# Altium schematic sheet NIR-Spec-Motherboard-SCH_SH1_(02).SchDoc: SCHEMATIC, CCA,
size 863 x 558 mm; DocumentNumber: NIR-Spec-1; SheetNumber: 1; SheetTotal: 3
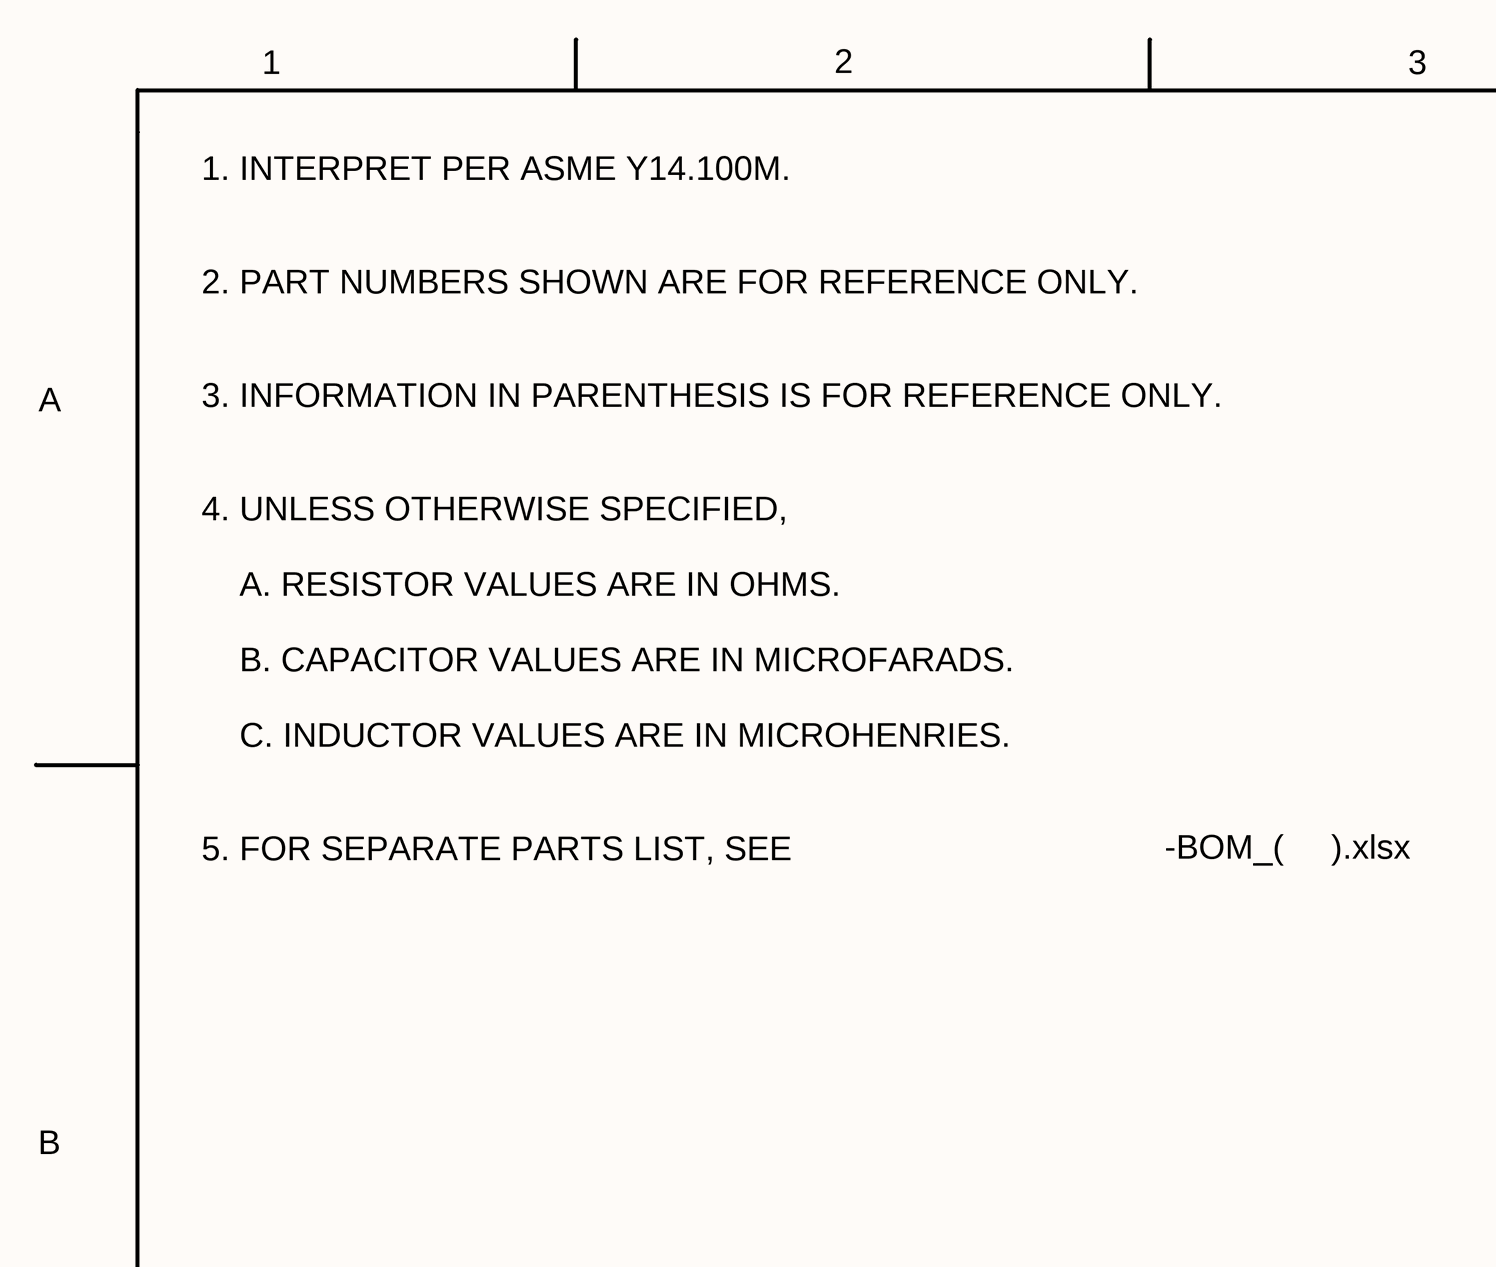
[diagram p0: NIR-Spec-Motherboard-SCH_SH1_(02).SchDoc, top left]
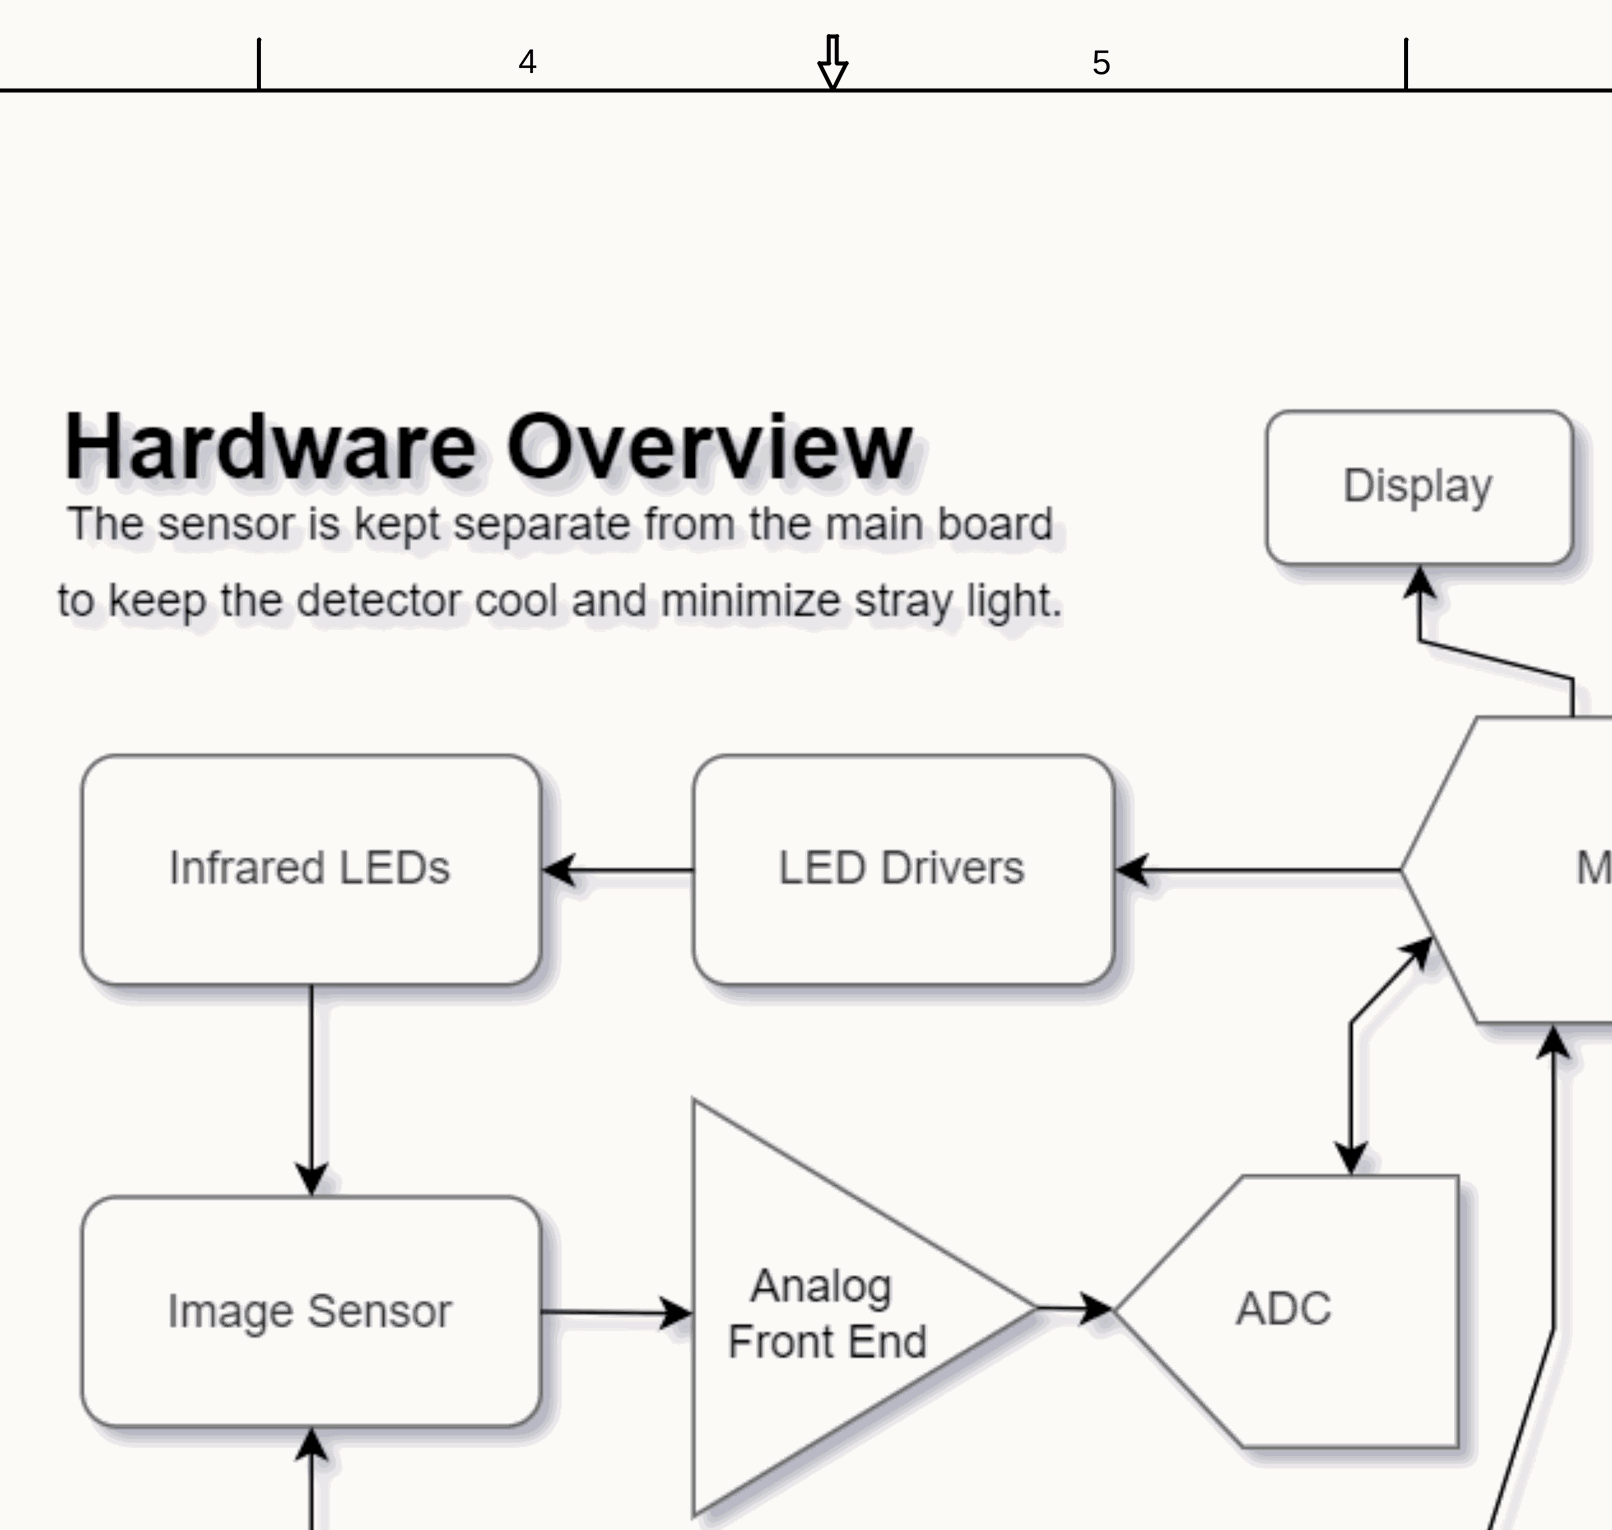
[diagram p1: NIR-Spec-Motherboard-SCH_SH1_(02).SchDoc, top middle]
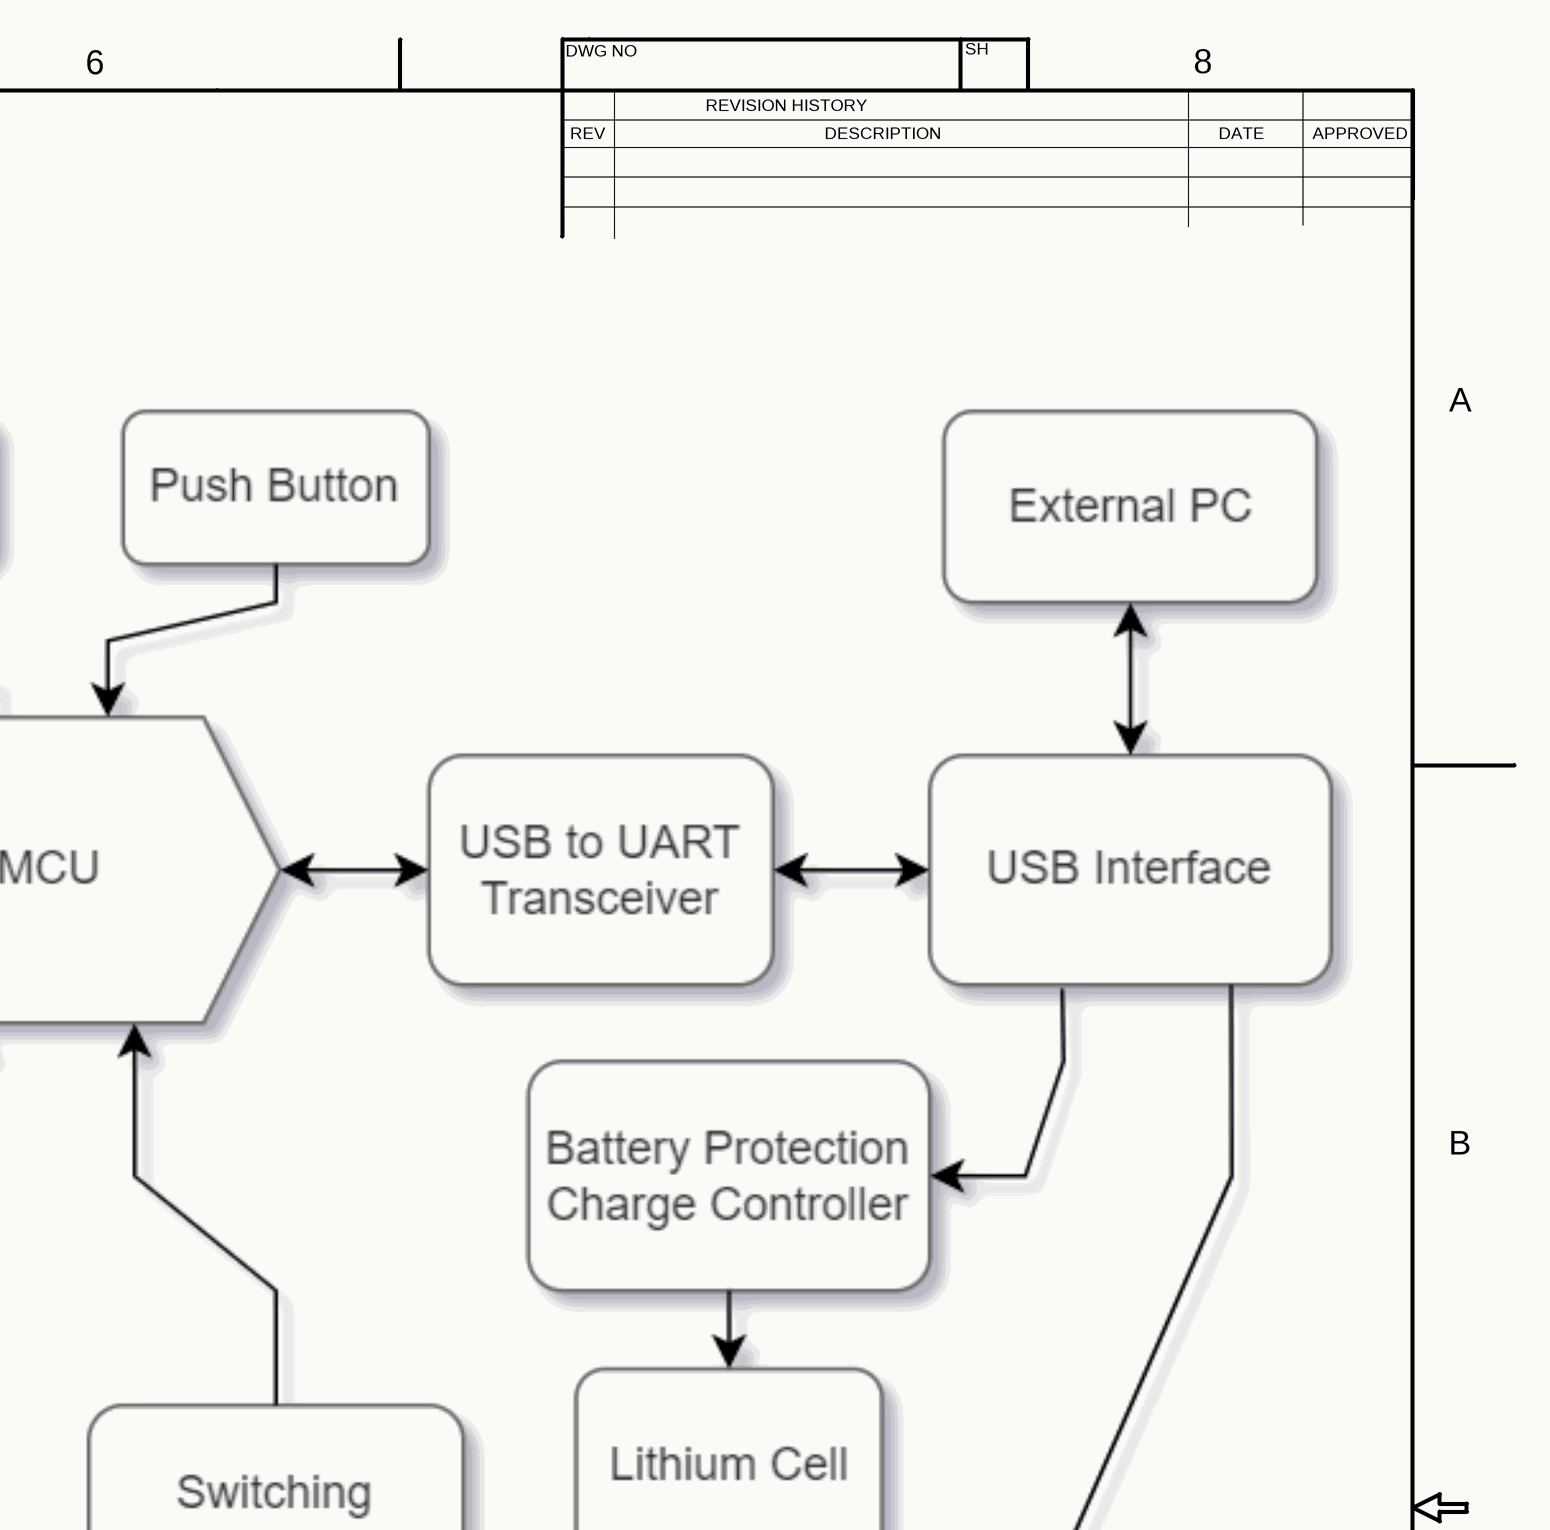
[diagram p2: NIR-Spec-Motherboard-SCH_SH1_(02).SchDoc, top right]
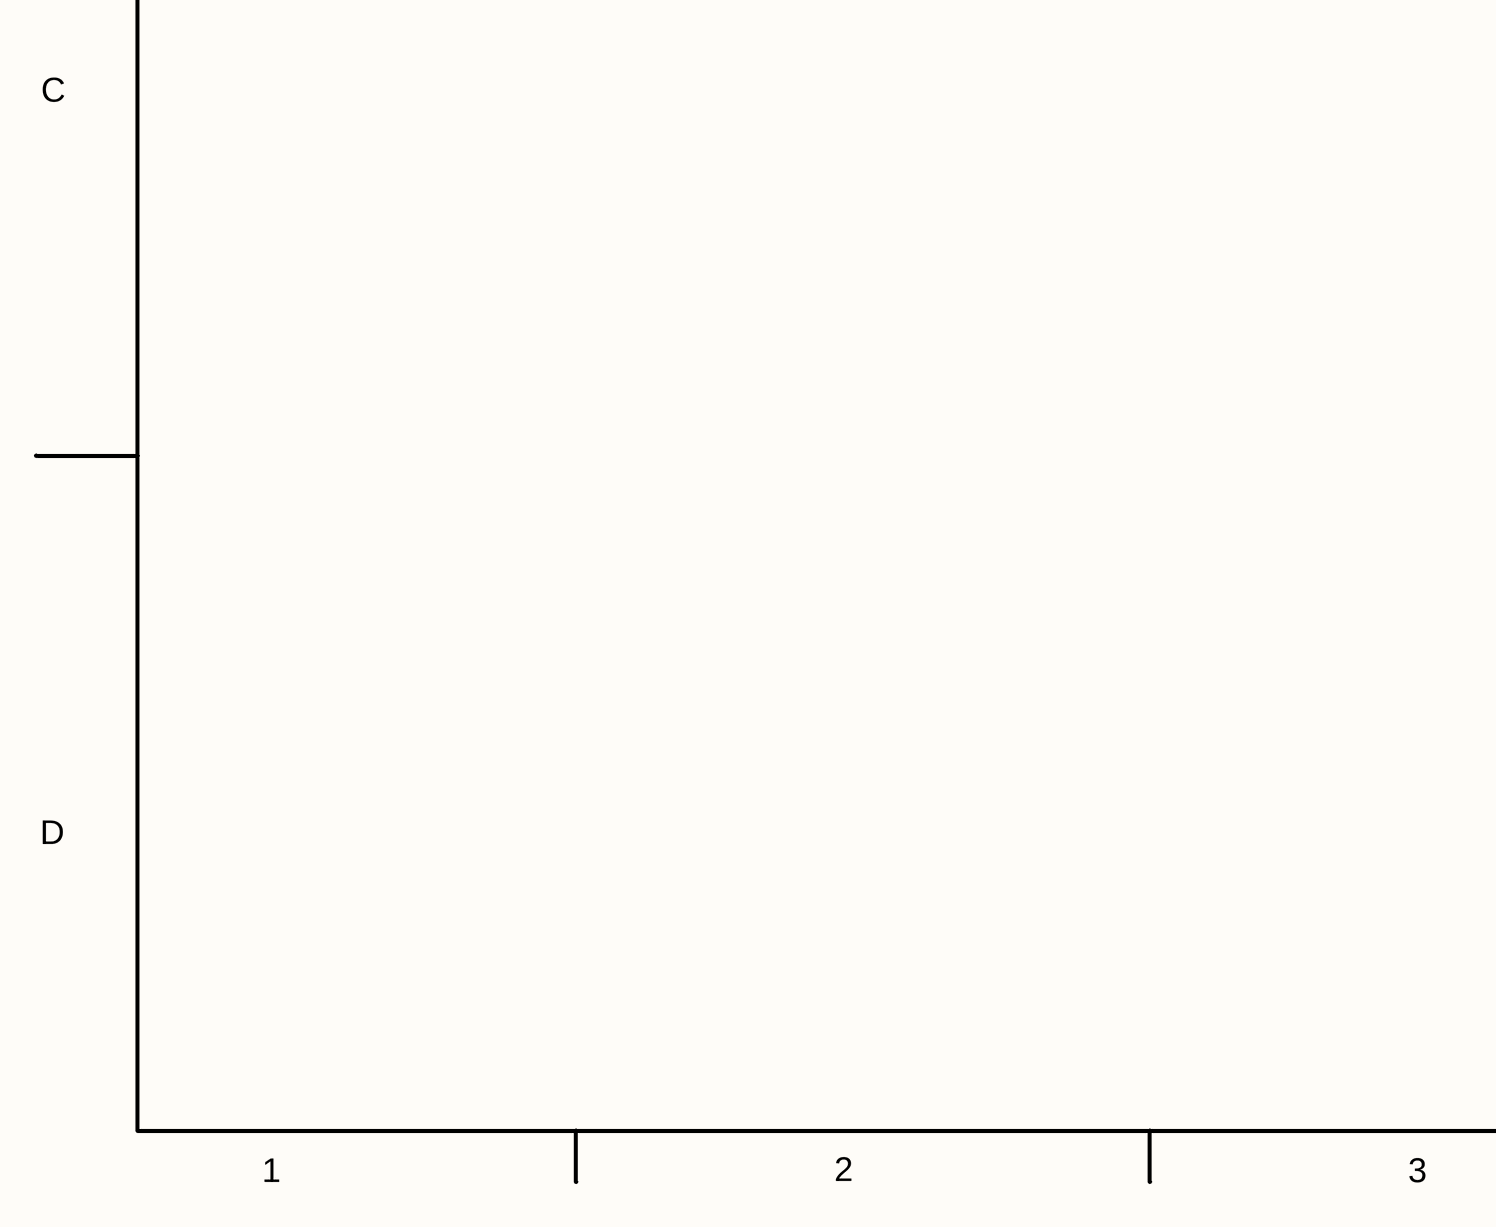
[diagram p3: NIR-Spec-Motherboard-SCH_SH1_(02).SchDoc, bottom left]
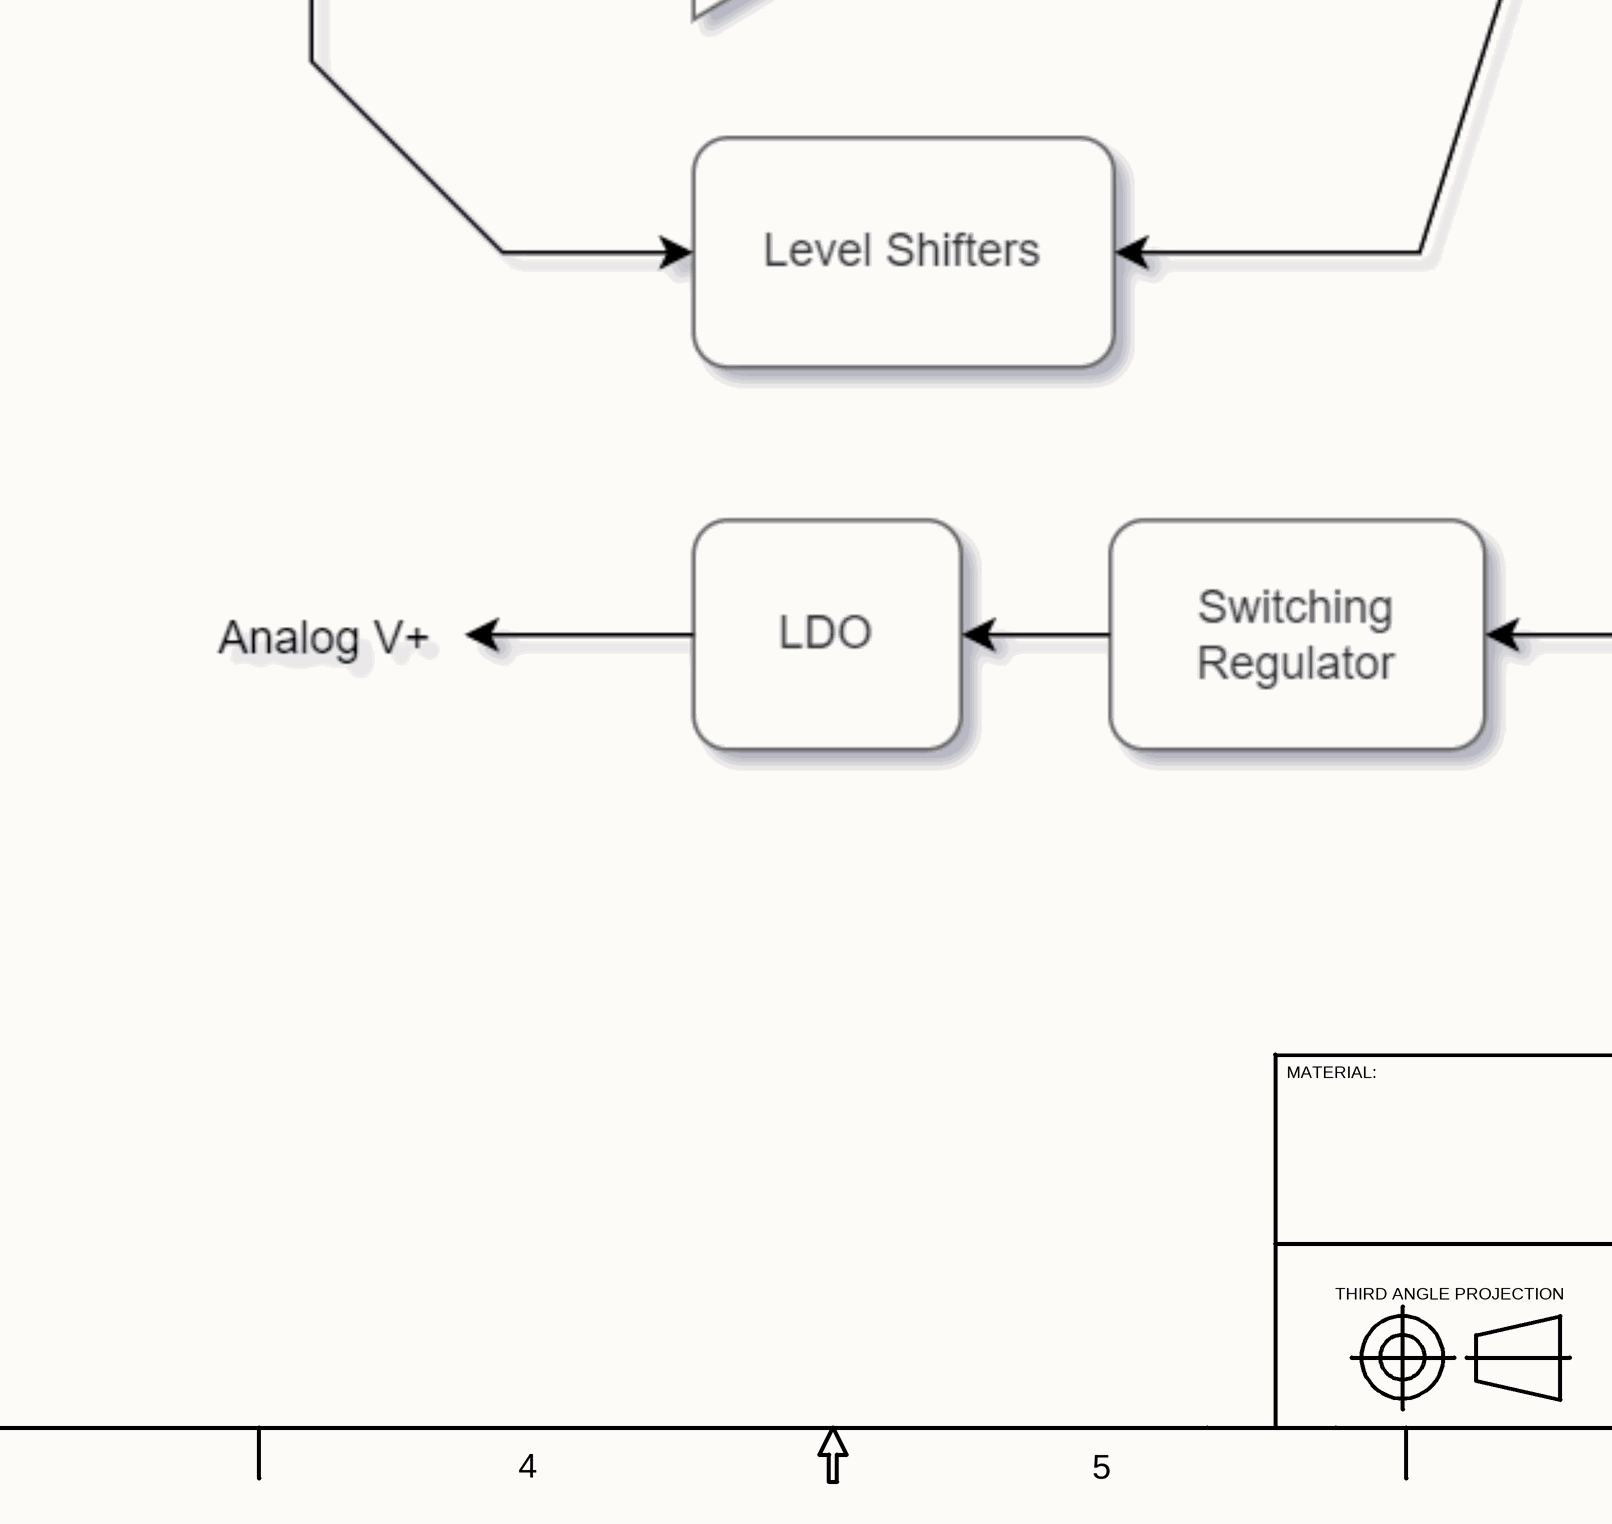
[diagram p4: NIR-Spec-Motherboard-SCH_SH1_(02).SchDoc, bottom middle]
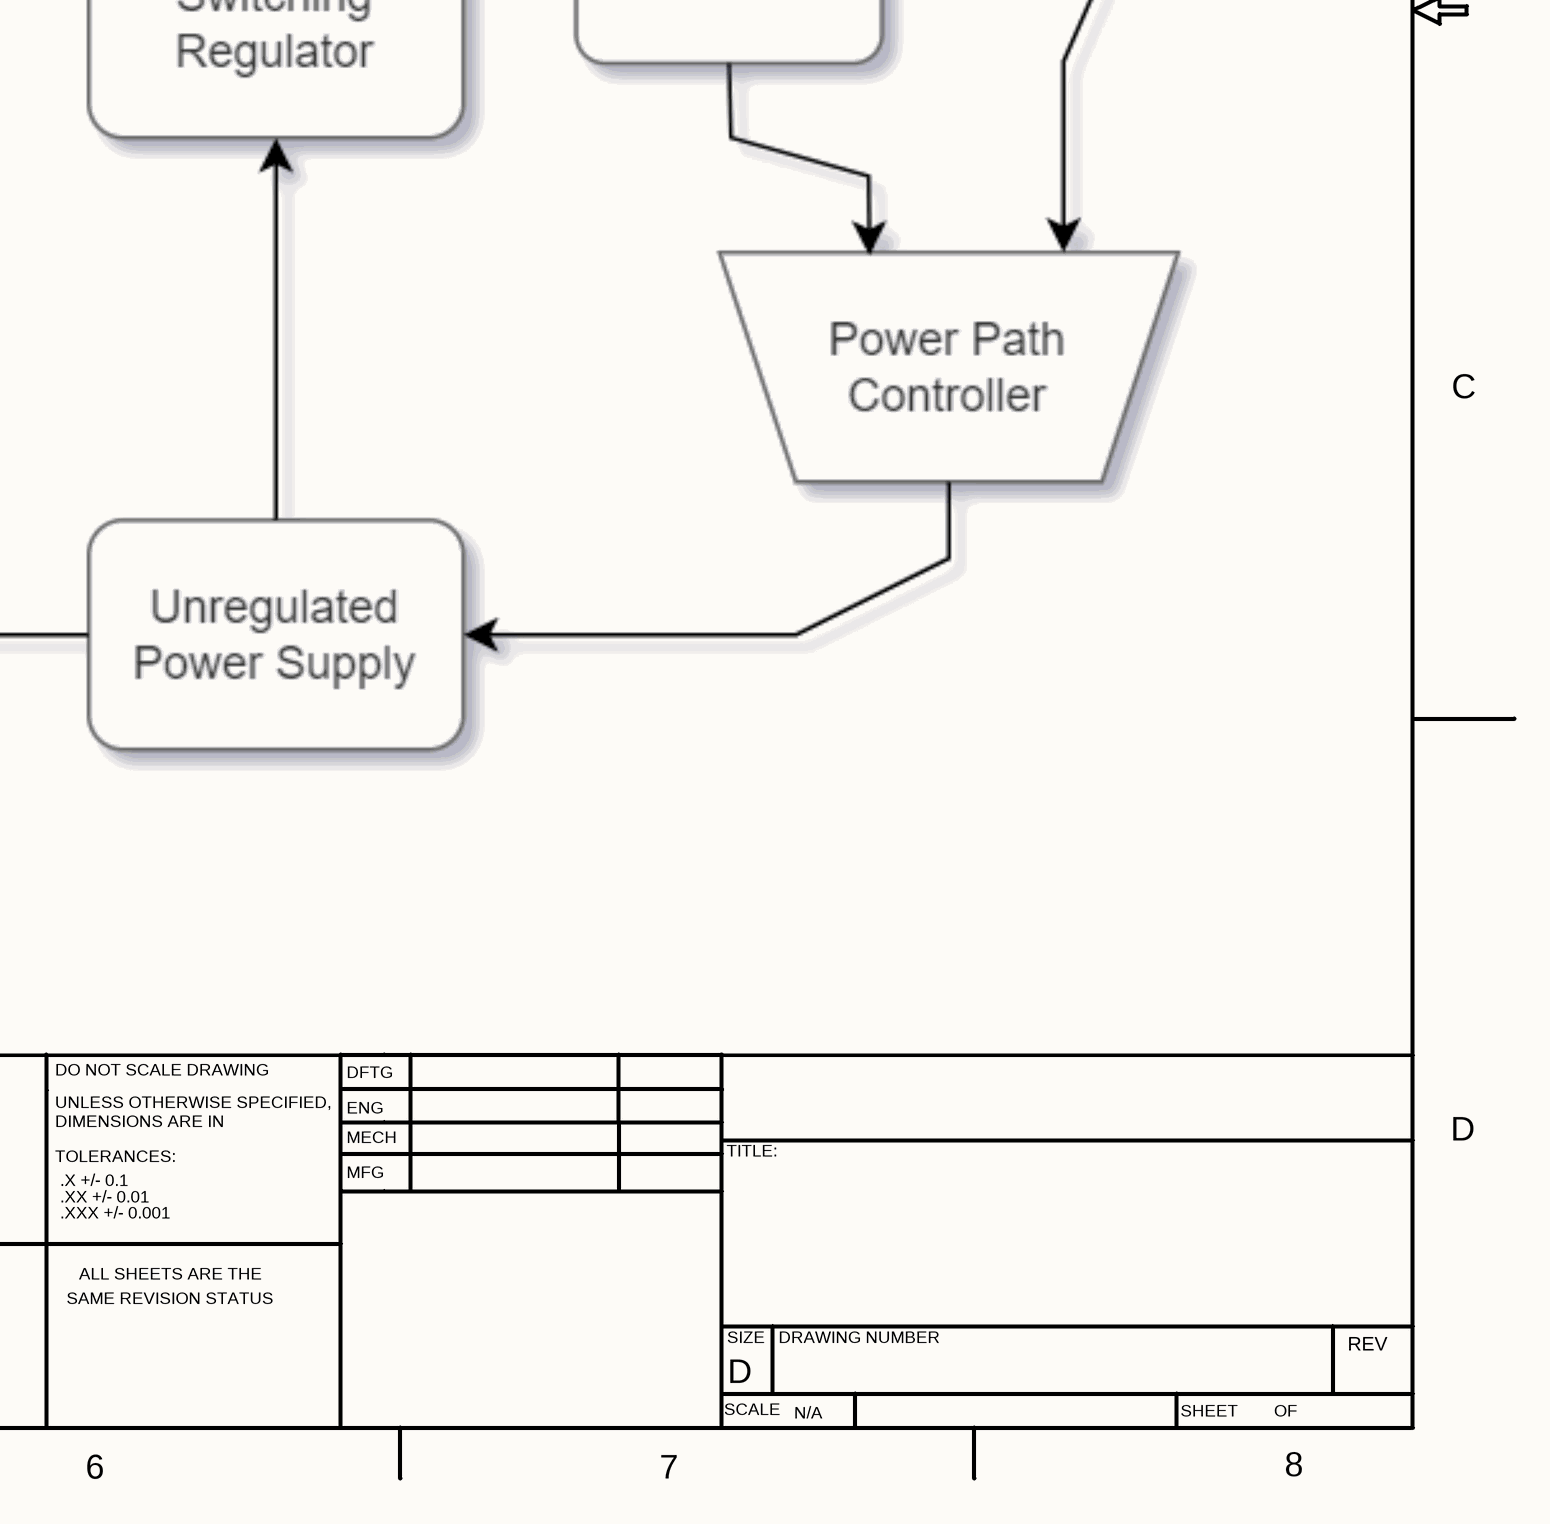
[diagram p5: NIR-Spec-Motherboard-SCH_SH1_(02).SchDoc, bottom right]

## Notes on the sheet
- 1
- 2
- 3
- 4
- 5
- 6
- DWG NO
- REVISION HISTORY
- SH
- 8
- REV
- DESCRIPTION
- DATE
- APPROVED
- A
- -BOM_(
- ).xlsx
- 1. INTERPRET PER ASME Y14.100M.
  2. PART NUMBERS SHOWN ARE FOR REFERENCE ONLY.
  3. INFORMATION IN PARENTHESIS IS FOR REFERENCE ONLY.
  4. UNLESS OTHERWISE SPECIFIED,
  A. RESISTOR VALUES ARE IN OHMS.
  B. CAPACITOR VALUES ARE IN MICROFARADS.
  C. INDUCTOR VALUES ARE IN MICROHENRIES.
  5. FOR SEPARATE PARTS LIST, SEE
- B
- C
- MATERIAL:
- DO NOT SCALE DRAWING
- UNLESS OTHERWISE SPECIFIED,
- ENG
- DFTG
- D
- DIMENSIONS ARE IN
- TOLERANCES:
- MECH
- MFG
- TITLE:
- .X +/- 0.1
- .XX +/- 0.01
- .XXX +/- 0.001
- THIRD ANGLE PROJECTION
- SAME REVISION STATUS
- ALL SHEETS ARE THE
- SIZE
- DRAWING NUMBER
- SCALE
- N/A
- SHEET        OF
- 7